# Altium project PCB_Project.PrjPcb
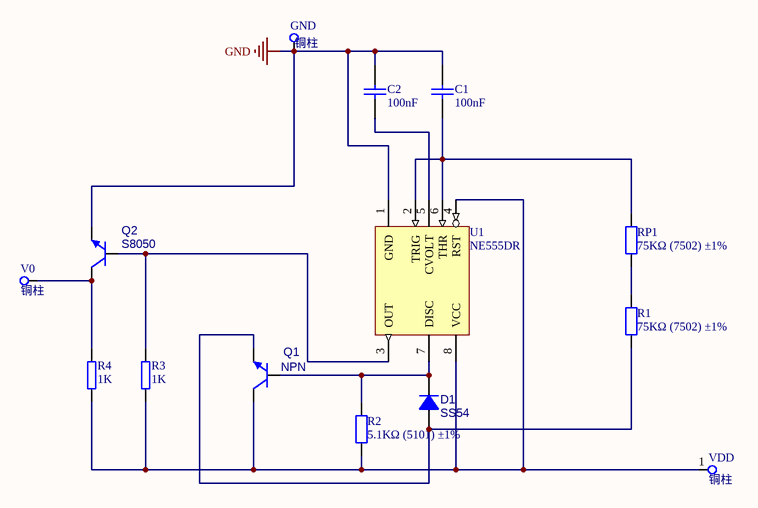
[diagram p0: NE555.SchDoc]
1 sheet, 14 parts. Net scope: global (net labels, ports and power ports of the same name join across sheets).
Board file: NE555.PcbDoc

## Sheet NE555.SchDoc
size A4

### Parts
C1  value 100nF  [HDR1X2]  (hidden comment: 100nF ±10% 50V)
C2  value 100nF  [CAPC1608[0603]S-N]  (hidden comment: 100nF ±10% 50V)
D1  SS54  [SMA[DO-214AC]]
GND  铜柱  [铜柱]
Q1  NPN  [SOT-23]
Q2  S8050  [SOT-23]
R1  75KΩ (7502) ±1%  [RESC1608[0603]S-N]
R2  5.1KΩ (5101) ±1%  [RESC1608[0603]S-N]
R3  value 1K  [RESC1608[0603]S-N]  (hidden comment: 1K ±1%)
R4  value 1K  [RESC1608[0603]S-N]  (hidden comment: 1K ±1%)
RP1  75KΩ (7502) ±1%  [RESC1608[0603]S-N]
U1  NE555DR  [NE555DR]
V0  铜柱  [铜柱]
VDD  铜柱  [铜柱]

### Nets
GND: C1.2 C2.1 GND.1 Q2.2(E) U1.1(GND)
NetC1_1: C1.1 RP1.2 U1.2(TRIG) U1.6(THR)
NetC2_2: C2.2 U1.5(CVOLT)
NetD1_A: D1.A Q1.2(E) R1.1
NetD1_K: D1.K Q1.1(B) R2.2 U1.7(DISC)
NetQ1_3: Q1.3(C) R2.1 R3.1 R4.1 U1.4(RST) U1.8(VCC) VDD.1
NetQ2_1: Q2.1(B) R3.2 U1.3(OUT)
NetQ2_3: Q2.3(C) R4.2 V0.1
NetR1_2: R1.2 RP1.1

### Library data of the parts
C1 C2 = Cap-Chip_1: 贴片电容; Published: 8-Jun-2000; Revision: July-2002: Re-released for DXP Platform.; Publisher: Altium Limited; Price(RMB): 0.000; Voltage: 50V; Tolerance: ±10%
D1 = Diode: 普通二极管 Diode; Imax: 500mA; Published: 8-Jun-2000; Revision: July-2002: Re-released for DXP Platform.; Publisher: Altium Limited; Price(RMB): 0.000
GND V0 VDD = 铜柱: 2.1mm
Q1 Q2 = NPN S8050: Discrete NPN Bipolar Transistor; Published: 8-Jun-2000; Revision: July-2002: Re-released for DXP Platform.; Publisher: Altium Limited; Price(RMB): 0.000
  Q1: PartNumber: NPN
  Q2: PartNumber: S8050
R1 RP1 = 0603 75KΩ (7502) 1%: 贴片电阻; ComponentLink1Description: 供应商链接; ComponentLink1URL: http://www.szlcsc.com/product/details_23969.html; Package: 0603; Supplier: LC; SuppliersPartNumber: C23242
R2 = 0603 5.1KΩ (5101) 1%: 贴片电阻; ComponentLink1Description: 供应商链接; ComponentLink1URL: http://www.szlcsc.com/product/details_23913.html; Package: 0603; Supplier: LC; SuppliersPartNumber: C23186
R3 R4 = Res-Chip_2: 贴片电阻; Published: 8-Jun-2000; Revision: July-2002: Re-released for DXP Platform.; Publisher: Altium Limited; Price(RMB): 0.000; Tolerance: ±1%
U1 = NE555DR_[C7593]: 时基集成; ComponentLink1Description: 供应商链接; ComponentLink1URL: http://www.szlcsc.com/product/details_8070.html; Package: SOIC-8_150mil; Supplier: LC; SuppliersPartNumber: C7593